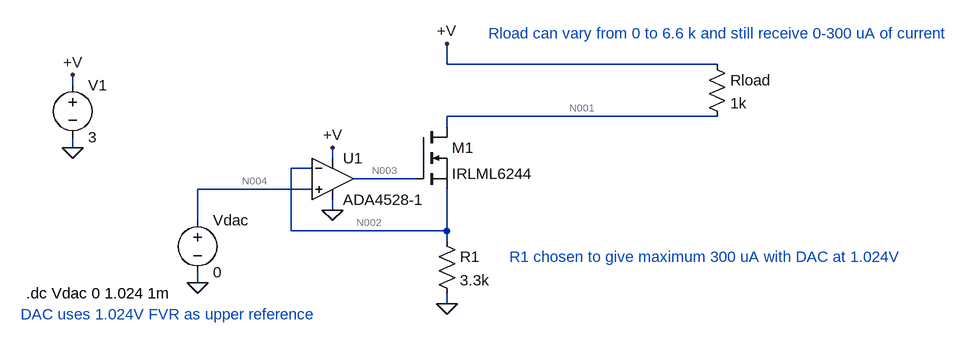
[diagram p0: schematic mosfet-current-source.asc]
mosfet-current-source.asc, the LTspice schematic file:
Version 4
SHEET 1 1088 680
WIRE 256 32 256 0
WIRE 672 32 256 32
WIRE -320 64 -320 48
WIRE 672 112 256 112
WIRE 256 128 256 112
WIRE -320 160 -320 144
WIRE 80 176 80 160
WIRE 48 192 16 192
WIRE 208 208 112 208
WIRE 48 224 -128 224
WIRE 80 256 80 240
WIRE -128 272 -128 224
WIRE 16 288 16 192
WIRE 256 288 256 224
WIRE 256 288 16 288
WIRE 256 304 256 288
WIRE -128 368 -128 352
WIRE 256 400 256 384
FLAG 256 400 0
FLAG 80 256 0
FLAG 80 160 +V
FLAG 256 0 +V
FLAG -128 368 0
FLAG -320 160 0
FLAG -320 48 +V
SYMBOL nmos 208 128 R0
SYMATTR InstName M1
SYMATTR Value IRLML6244
SYMBOL res 240 288 R0
SYMATTR InstName R1
SYMATTR Value 3.3k
SYMBOL res 656 16 R0
SYMATTR InstName Rload
SYMATTR Value 1k
SYMBOL voltage -320 48 R0
WINDOW 123 0 0 Left 0
WINDOW 39 0 0 Left 0
SYMATTR InstName V1
SYMATTR Value 3
SYMBOL voltage -128 256 R0
WINDOW 123 0 0 Left 0
WINDOW 39 0 0 Left 0
SYMATTR InstName Vdac
SYMATTR Value 0
SYMBOL Opamps\\ADA4528-1 80 144 R0
SYMATTR InstName U1
TEXT -392 384 Left 2 !.dc Vdac 0 1.024 1m
TEXT 320 -16 Left 2 ;Rload can vary from 0 to 6.6 k and still receive 0-300 uA of current
TEXT -400 416 Left 2 ;DAC uses 1.024V FVR as upper reference
TEXT 352 328 Left 2 ;R1 chosen to give maximum 300 uA with DAC at 1.024V

The netlist it stands for:
* mosfet-current-source.asc
M1 N001 N003 N002 N002 IRLML6244
R1 N002 0 3.3k
Rload +V N001 1k
V1 +V 0 3
Vdac N004 0 0
XU1 N004 N002 +V 0 N003 ADA4528-1  ; pins In+ In- V+ V- OUT
.model NMOS NMOS
.model PMOS PMOS
.lib standard.mos
.dc Vdac 0 1.024 1m
* Rload can vary from 0 to 6.6 k and still receive 0-300 uA of current
* DAC uses 1.024V FVR as upper reference
* R1 chosen to give maximum 300 uA with DAC at 1.024V
.backanno
.end

* Results of the author's LTspice run, read from the files saved beside the schematic
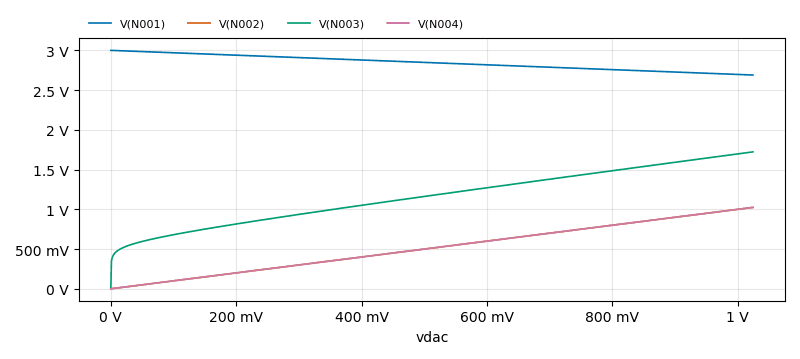
[diagram p1: DC transfer characteristic of mosfet-current-source.asc, plotted from the saved traces]
* DC transfer characteristic, 1 run:
*   V(N001): 3 V at vdac=0 V, 2.69 V at vdac=1.024 V, min 2.69 V, max 3 V
*   V(N002): 1.828 µV at vdac=0 V, 1.024 V at vdac=1.024 V, min 1.828 µV, max 1.024 V
*   V(N003): 6.082 mV at vdac=0 V, 1.723 V at vdac=1.024 V, min 6.082 mV, max 1.723 V
*   V(N004): 0 V at vdac=0 V, 1.024 V at vdac=1.024 V, min 0 V, max 1.024 V